# EasyEDA Pro project ProPrj_TK021F2699-RGB_转接板_24位_并联_2024-11-26.epro

# Schematic TK021F2699-RGB_转接板_24位_并联
Board Name: TK021F2699-RGB_转接板_24位_并联; Create Date: 2024-10-23; Page Name: Sheet_1; Project Name: TK021F2699-RGB_转接板_椭圆-24位; Schematic Name: TK021F2699-RGB_转接板_24位_并联; Update Date: 2024-10-23; Add into BOM: yes; Company: NULL Studio; Convert to PCB: yes; Date: 2022-07-25; Draw By: zhouao; REV: 1.0; Sheet: 1/1
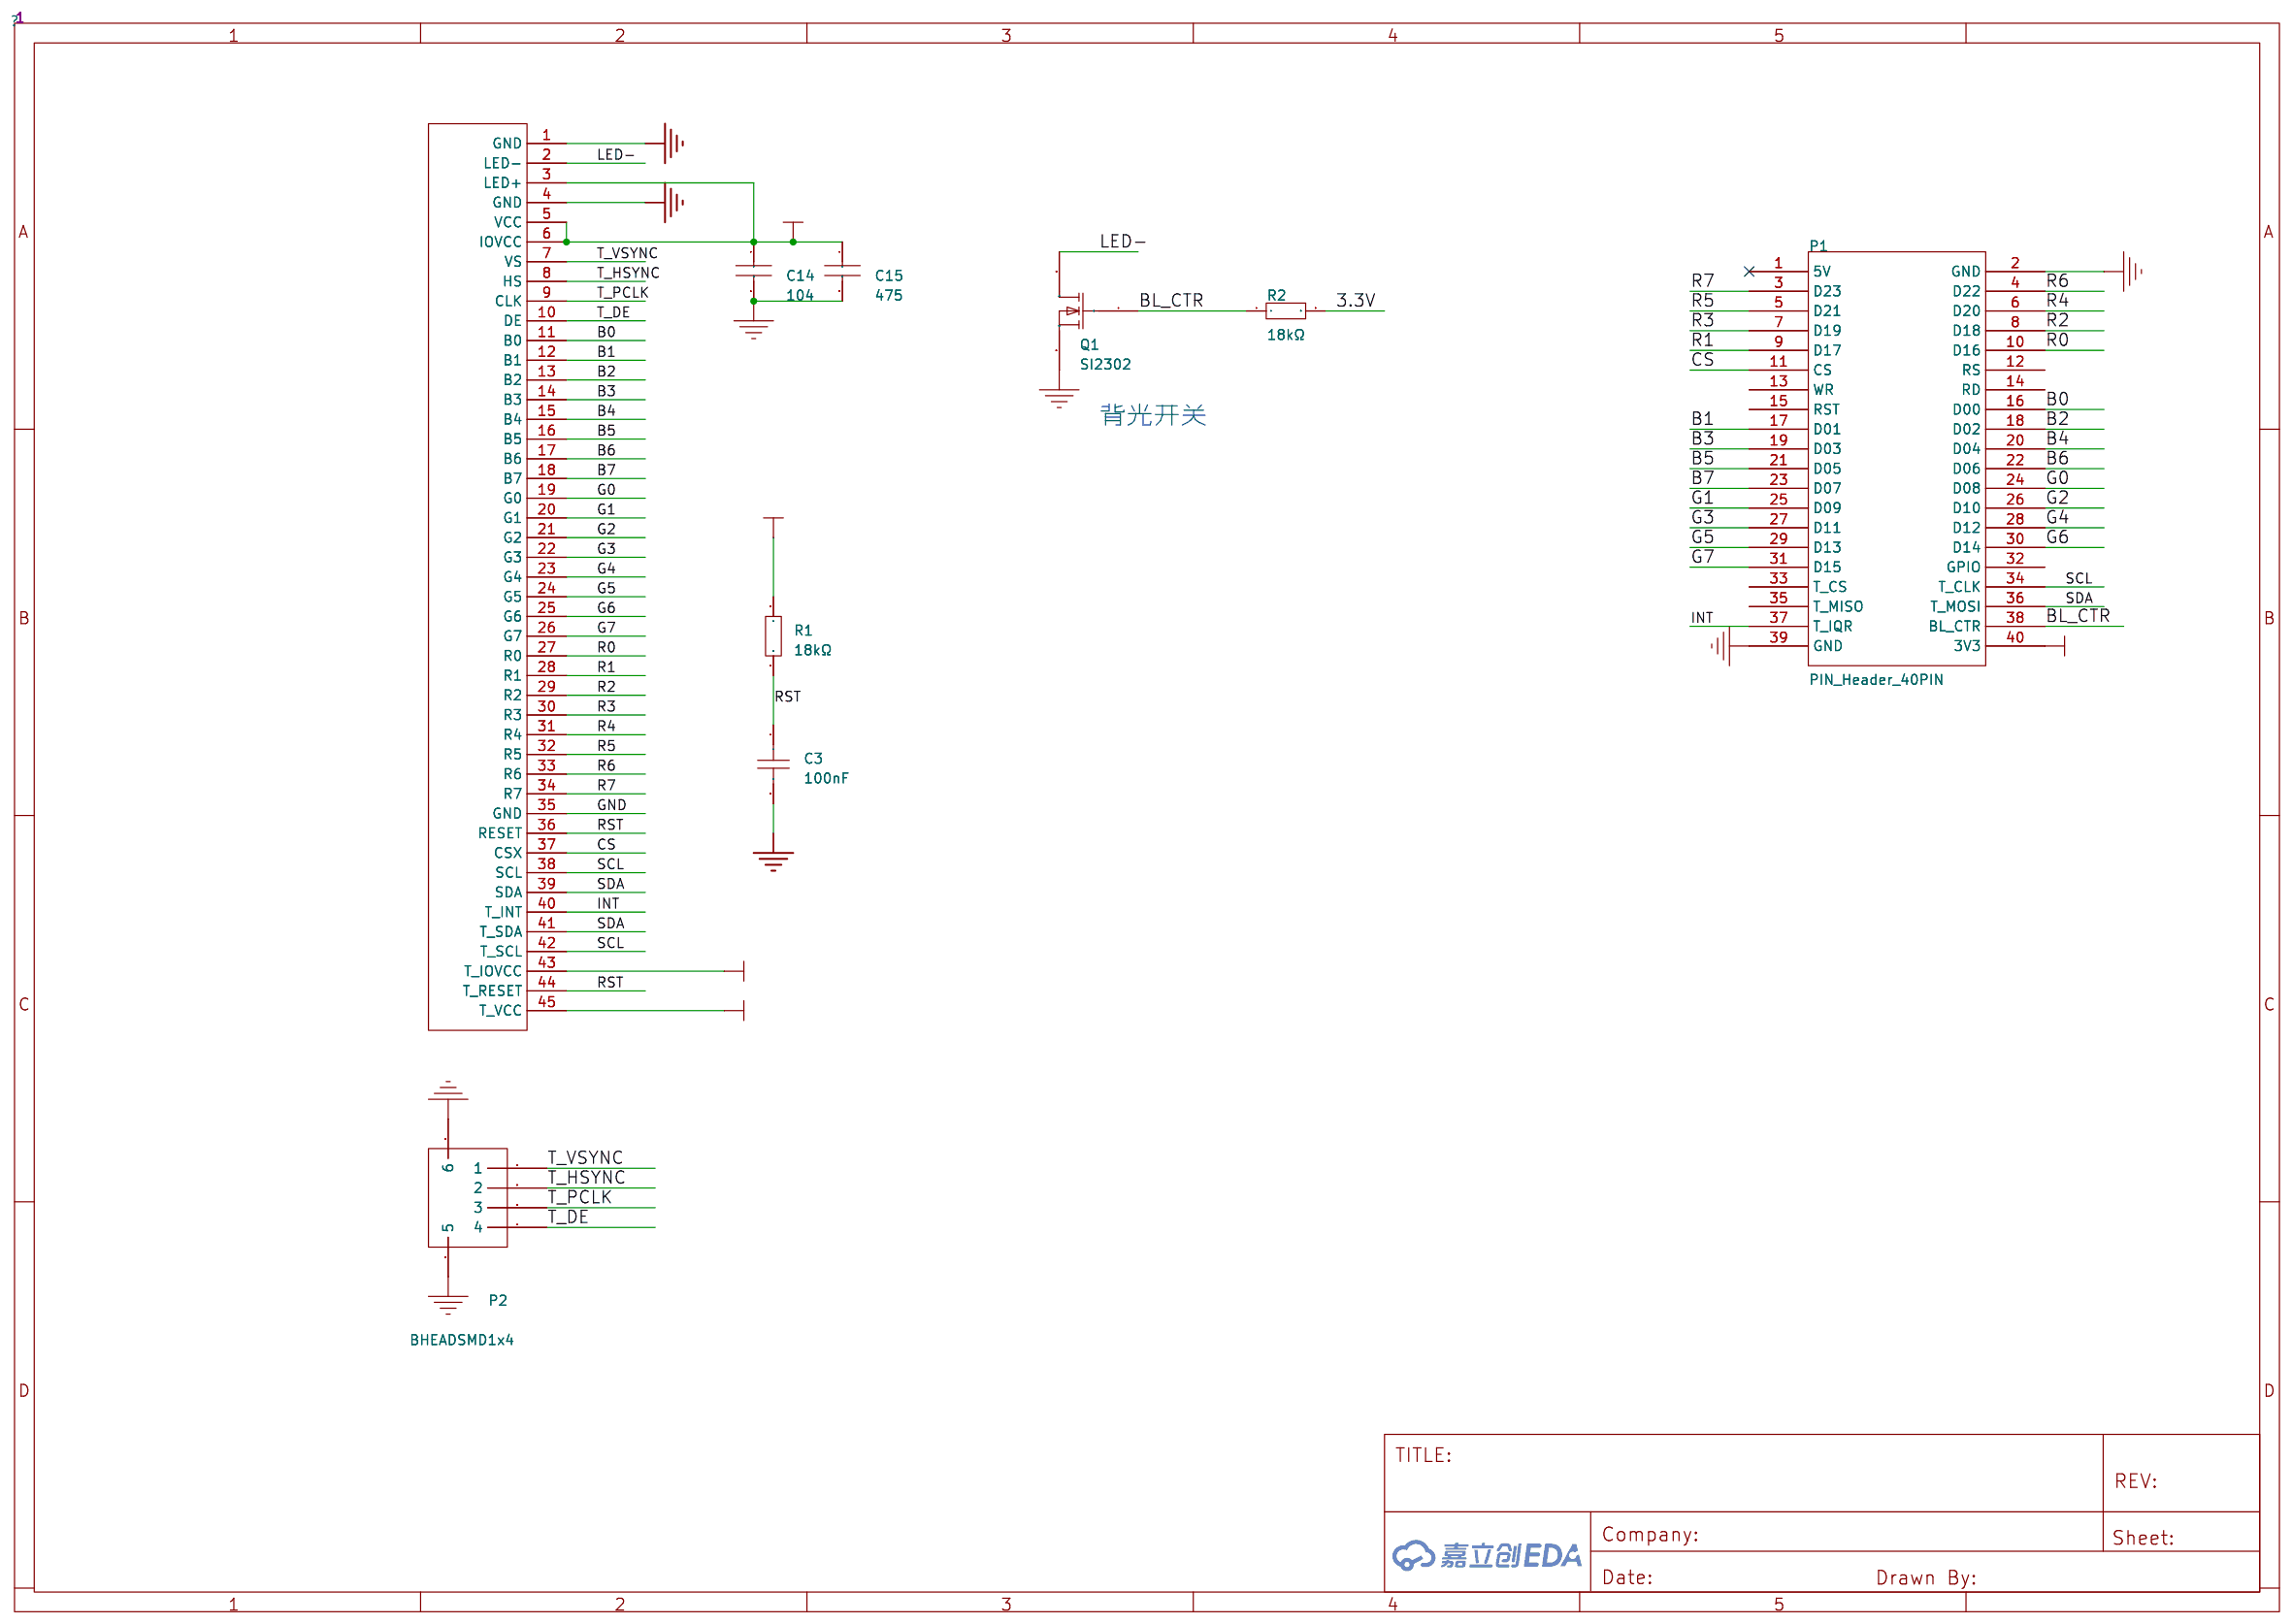
[diagram p0: schematic sheet]

## Parts
C3  100nF  [C0603]
C14  104  [C0603-1]
C15  475  [C0603-2]
P1  PIN_Header_40PIN  [P_Head_2x20]
P2  BHEADSMD1x4  [BHEADSMD1x4]
Q1  SI2302  [SOT23A]
R1  18kΩ  [R0603]
R2  18kΩ  [R0603]
U1  -  [TK043F-45P]

## Library data of the parts
C3 = CC0603KRX7R9BB104: 容值:100nF;精度:±10%;额定电压:50V;材质(温度系数):X7R;; LCSC Part Name: 100nF ±10% 50V; Supplier Part: C14663; Manufacturer: YAGEO(国巨); Supplier Footprint: 0603; Datasheet: https://atta.szlcsc.com/upload/public/pdf/source/20180910/C282072_33301C7F631E79921B82A8DAC6BCC5B3.pdf; Supplier: LCSC; Tolerance: ±10%; Voltage Rated: 50V; Temperature Coefficient: X7R
C14 = 104: Origin Footprint 2: C0402-2; Origin Footprint 3: C0402-3; Origin Footprint 5: C0603-2; Origin Footprint 6: C0603-3; Origin Footprint 7: C0805-1; Origin Footprint 8: C0805-2; Origin Footprint 9: C0805-3; Origin Footprint 10: Case B 3528; Design Item ID: cap; Library Name: Tiky
C15 = 475: Origin Footprint 2: C0402-1; Origin Footprint 3: C0402-2; Origin Footprint 4: C0402-3; Origin Footprint 5: C0603-1; Origin Footprint 6: C0603-3; Origin Footprint 7: C0805-1; Origin Footprint 8: C0805-2; Origin Footprint 9: C0805-3; Origin Footprint 10: Case B 3528; Design Item ID: cap; Library Name: Tiky
P1 = PIN_Header_40PIN: Library Name: Tiky
P2 = BHEADSMD1x4: Library Name: Tiky
Q1 = MOSFET-N: Library Name: Tiky
R1 R2 = 0603WAF1802T5E: 电阻类型:厚膜电阻;阻值:18kΩ;精度:±1%;功率:100mW;最大工作电压:75V;温度系数:±100ppm/℃;; LCSC Part Name: 18kΩ ±1% 100mW 厚膜电阻; Supplier Part: C25810; Manufacturer: UNI-ROYAL(厚声); Supplier Footprint: 0603; JLCPCB Part Class: 基础库; Datasheet: https://atta.szlcsc.com/upload/public/pdf/source/20200306/C422600_1E6D84923E4A46A82E41ADD87F860B5C.pdf; Supplier: LCSC; Type: 厚膜电阻; Tolerance: ±1%; Power(Watts): 100mW; Overload Voltage (Max): 75V; Temperature Coefficient: ±100ppm/℃; Operating Temperature Range: -55℃~+155℃
U1 = TK-RGB-45P

## Nets
3.3V: C14.1 C15.1 P1.40(3V3) R1.2 R2.2 U1.3(LED+) U1.5(VCC) U1.6(IOVCC) U1.43(T_IOVCC) U1.45(T_VCC)
GND: C3.2 C14.2 C15.2 P1.2(GND) P1.39(GND) P2.5 P2.6 Q1.2(S) U1.1(GND) U1.4(GND) U1.35(GND)
B0: P1.16(D00) U1.11(B0)
B1: P1.17(D01) U1.12(B1)
B2: P1.18(D02) U1.13(B2)
B3: P1.19(D03) U1.14(B3)
B4: P1.20(D04) U1.15(B4)
B5: P1.21(D05) U1.16(B5)
B6: P1.22(D06) U1.17(B6)
B7: P1.23(D07) U1.18(B7)
BL_CTR: P1.38(BL_CTR) Q1.1(G) R2.1
CS: P1.11(CS) U1.37(CSX)
G0: P1.24(D08) U1.19(G0)
G1: P1.25(D09) U1.20(G1)
G2: P1.26(D10) U1.21(G2)
G3: P1.27(D11) U1.22(G3)
G4: P1.28(D12) U1.23(G4)
G5: P1.29(D13) U1.24(G5)
G6: P1.30(D14) U1.25(G6)
G7: P1.31(D15) U1.26(G7)
INT: P1.37(T_IQR) U1.40(T_INT)
LED-: Q1.3(D) U1.2(LED-)
R0: P1.10(D16) U1.27(R0)
R1: P1.9(D17) U1.28(R1)
R2: P1.8(D18) U1.29(R2)
R3: P1.7(D19) U1.30(R3)
R4: P1.6(D20) U1.31(R4)
R5: P1.5(D21) U1.32(R5)
R6: P1.4(D22) U1.33(R6)
R7: P1.3(D23) U1.34(R7)
RST: C3.1 R1.1 U1.36(RESET) U1.44(T_RESET)
SCL: P1.34(T_CLK) U1.38(SCL) U1.42(T_SCL)
SDA: P1.36(T_MOSI) U1.39(SDA) U1.41(T_SDA)
T_DE: P2.4 U1.10(DE)
T_HSYNC: P2.2 U1.8(HS)
T_PCLK: P2.3 U1.9(CLK)
T_VSYNC: P2.1 U1.7(VS)

Not connected (* = marked no-connect by the designer): P1 1(5V)* 12(RS) 13(WR) 14(RD) 15(RST) 32(GPIO) 33(T_CS) 35(T_MISO)

## Notes on the sheet
- 背光开关

# Board TK021F2699-RGB_转接板_24位_并联
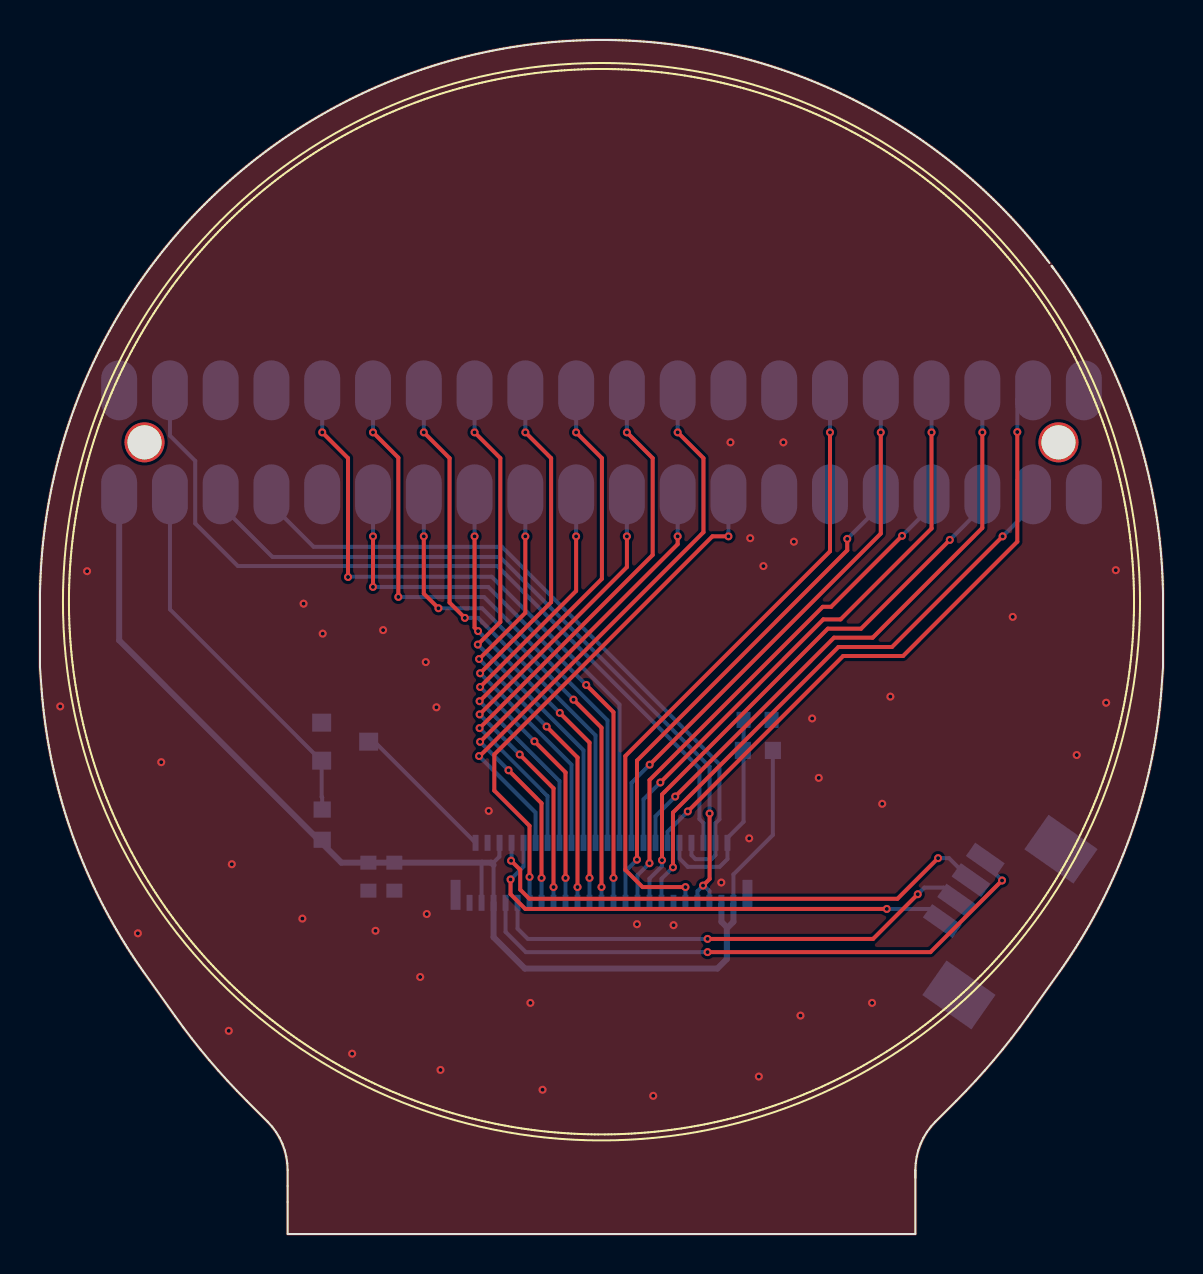
[diagram p1: board, top side]
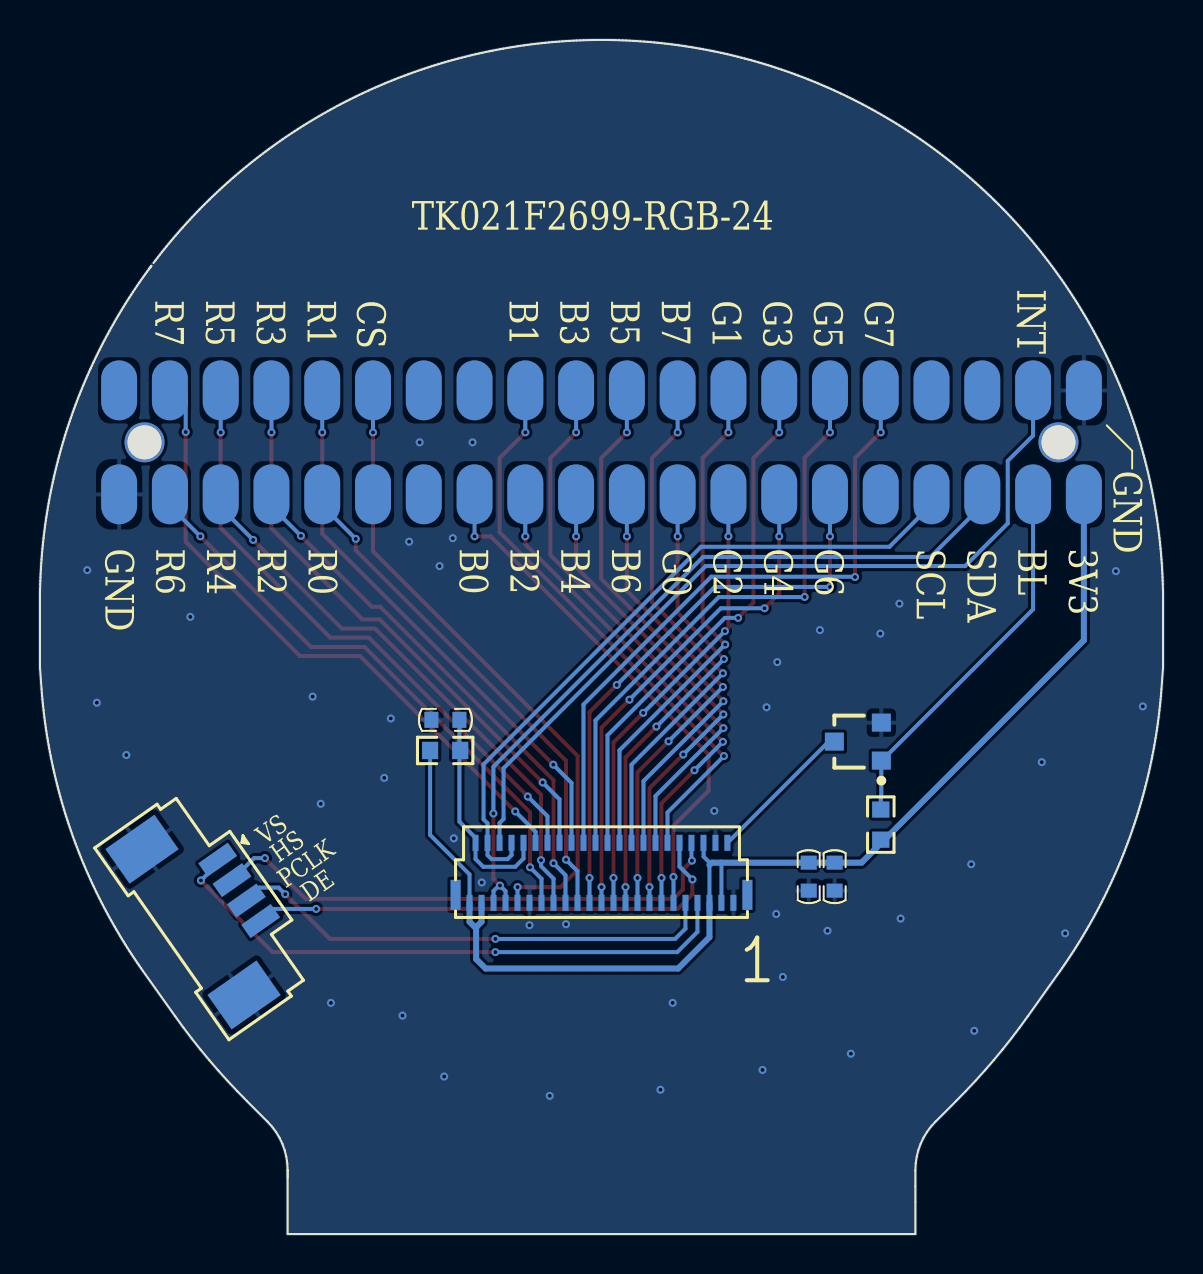
[diagram p2: board, bottom side, seen from below]

Outline 56.18 x 59.71 mm; copper layers: Top Layer, Bottom Layer. Coordinates in mm from the lower left corner of the outline.
Outline path: 43.79,3.19 43.79,0 12.39,0 12.39,3.19 12.37,3.53 12.32,3.87 12.24,4.19 12.13,4.51 11.99,4.81 11.81,5.1 11.61,5.37 11.39,5.62 10.34,6.66 9.86,7.16 9.38,7.66 8.92,8.18 8.47,8.7 8.02,9.24 7.59,9.78 7.17,10.33 6.77,10.89 5.16,13.15 5.06,13.29 4.96,13.44 4.86,13.58 4.76,13.73 4.66,13.87 4.56,14.02 4.47,14.17 4.37,14.32 4.28,14.47 4.19,14.62 4.09,14.77 4,14.92 3.91,15.07 3.82,15.22 3.73,15.38 3.65,15.53 3.56,15.68 3.47,15.84 3.39,15.99 3.31,16.15 3.22,16.3 3.14,16.46 3.06,16.62 2.98,16.78 2.9,16.93 2.83,17.09 2.75,17.25 2.67,17.41 2.6,17.57 2.52,17.73 2.45,17.89 2.38,18.05 2.31,18.21 2.24,18.38 2.17,18.54 2.1,18.7 2.04,18.87 1.97,19.03 1.91,19.19 1.84,19.36 1.78,19.52 1.72,19.69 1.66,19.86 1.6,20.02 1.54,20.19 1.49,20.36 1.43,20.52 1.37,20.69 1.32,20.86 1.27,21.03 1.22,21.19 1.16,21.36 1.11,21.53 1.07,21.7 1.02,21.87 0.97,22.04 0.93,22.21 0.88,22.38 0.84,22.56 0.8,22.73 0.76,22.9 0.72,23.07 0.68,23.24 0.64,23.42 0.6,23.59 0.57,23.76 0.53,23.93 0.5,24.11 0.47,24.28 0.43,24.45 0.4,24.63 0.37,24.8 0.35,24.98 0.32,25.15 0.29,25.33 0.27,25.5 0.24,25.67 0.22,25.85 0.2,26.02 0.18,26.2 0.16,26.38 0.14,26.55 0.12,26.73 0.11,26.9 0.09,27.08 0.08,27.25 0,28.36 0,32.01 0.01,32.5 0.02,32.68 0.03,32.86 0.04,33.03 0.04,33.21 0.06,33.38 0.07,33.56 0.08,33.74 0.09,33.91 0.11,34.09 0.12,34.26 0.14,34.44 0.16,34.61 0.18,34.79 0.2,34.97 0.22,35.14 0.24,35.32 0.27,35.49 0.29,35.67 0.32,35.84 0.35,36.01 0.37,36.19 0.4,36.36 0.43,36.54 0.47,36.71 0.5,36.88 0.53,37.06 0.57,37.23 0.6,37.4 0.64,37.58 0.68,37.75 0.72,37.92 0.76,38.09 0.8,38.26 0.84,38.43 0.88,38.61 0.93,38.78 0.97,38.95 1.02,39.12 1.07,39.29 1.11,39.46 1.16,39.63 1.22,39.8 1.27,39.96 1.32,40.13 1.37,40.3 1.43,40.47 1.49,40.64 1.54,40.8 1.6,40.97 1.66,41.14 1.72,41.3 1.78,41.47 1.84,41.63 1.91,41.8 1.97,41.96 2.04,42.12 2.1,42.29 2.17,42.45 2.24,42.61 2.31,42.78 2.38,42.94 2.45,43.1 2.52,43.26 2.6,43.42 2.67,43.58 2.75,43.74 2.83,43.9 2.9,44.06 2.98,44.22 3.06,44.37 3.14,44.53 3.22,44.69 3.31,44.84 3.39,45 3.47,45.15 3.56,45.31 3.65,45.46 3.73,45.61 3.82,45.77 3.91,45.92 4,46.07 4.09,46.22 4.19,46.37 4.28,46.52 4.37,46.67 4.47,46.82 4.56,46.97 4.66,47.12 4.76,47.26 4.86,47.41 4.96,47.55 5.06,47.7 5.16,47.84 5.26,47.99 5.36,48.13 5.47,48.27 5.57,48.42 5.68,48.56 5.79,48.7 5.89,48.84 6,48.98 6.11,49.11 6.22,49.25 6.33,49.39 6.45,49.53 6.56,49.66 6.67,49.8 6.79,49.93 6.9,50.06 7.02,50.2 7.14,50.33 7.25,50.46 7.37,50.59 7.49,50.72 7.61,50.85 7.73,50.98 7.86,51.1 7.98,51.23 8.1,51.36 8.23,51.48 8.35,51.61 8.48,51.73 8.61,51.85 8.73,51.98 8.86,52.1 8.99,52.22 9.12,52.34 9.25,52.46 9.38,52.57 9.51,52.69 9.65,52.81 9.78,52.92 9.91,53.04 10.05,53.15 10.18,53.26 10.32,53.38 10.46,53.49 10.6,53.6 10.73,53.71 10.87,53.82 11.01,53.92 11.15,54.03 11.29,54.14 11.44,54.24 11.58,54.35 11.72,54.45 11.87,54.55 12.01,54.65 12.15,54.75 12.3,54.85 12.45,54.95 12.59,55.05 12.74,55.15 12.89,55.24 13.04,55.34 13.19,55.43 13.34,55.52 13.49,55.62 13.64,55.71 13.79,55.8 13.94,55.89 14.1,55.98 14.25,56.06 14.4,56.15 14.56,56.24 14.71,56.32 14.87,56.4 15.02,56.49 15.18,56.57 15.34,56.65 15.49,56.73 15.65,56.81 15.81,56.88 15.97,56.96 16.13,57.04 16.29,57.11 16.45,57.19 16.61,57.26 16.77,57.33 16.93,57.4 17.1,57.47 17.26,57.54 17.42,57.61 17.59,57.67 17.75,57.74 17.91,57.8 18.08,57.87 18.24,57.93 18.41,57.99 18.57,58.05 18.74,58.11 18.91,58.17 19.07,58.22 19.24,58.28 19.41,58.33 19.58,58.39 19.75,58.44 19.91,58.49 20.08,58.55 20.25,58.59 20.42,58.64 20.59,58.69 20.76,58.74 20.93,58.78 21.1,58.83 21.27,58.87 21.45,58.91 21.62,58.95 21.79,58.99 21.96,59.03 22.13,59.07 22.31,59.11 22.48,59.14 22.65,59.18 22.83,59.21 23,59.25 23.17,59.28 23.35,59.31 23.52,59.34 23.7,59.36 23.87,59.39 24.04,59.42 24.22,59.44 24.39,59.47 24.57,59.49 24.74,59.51 24.92,59.53 25.09,59.55 25.27,59.57 25.45,59.59 25.62,59.6 25.8,59.62 25.97,59.63 26.15,59.64 26.33,59.65 26.5,59.67 26.68,59.67 26.85,59.68 27.03,59.69 27.21,59.7 27.38,59.7 27.56,59.7 27.74,59.71 27.91,59.71 28.09,59.71 28.27,59.71 28.44,59.71 28.62,59.7 28.8,59.7 28.97,59.7 29.15,59.69 29.33,59.68 29.5,59.67 29.68,59.67 29.85,59.65 30.03,59.64 30.21,59.63 30.38,59.62 30.56,59.6 30.73,59.59 30.91,59.57 31.08,59.55 31.26,59.53 31.43,59.51 31.61,59.49 31.79,59.47 31.96,59.44 32.14,59.42 32.31,59.39 32.48,59.36 32.66,59.34 32.83,59.31 33.01,59.28 33.18,59.25 33.35,59.21 33.53,59.18 33.7,59.14 33.87,59.11 34.05,59.07 34.22,59.03 34.39,58.99 34.56,58.95 34.73,58.91 34.9,58.87 35.08,58.83 35.25,58.78 35.42,58.74 35.59,58.69 35.76,58.64 35.93,58.59 36.1,58.55 36.27,58.49 36.43,58.44 36.6,58.39 36.77,58.33 36.94,58.28 37.11,58.22 37.27,58.17 37.44,58.11 37.61,58.05 37.77,57.99 37.94,57.93 38.1,57.87 38.27,57.8 38.43,57.74 38.59,57.67 38.76,57.61 38.92,57.54 39.08,57.47 39.25,57.4 39.41,57.33 39.57,57.26 39.73,57.19 39.89,57.11 40.05,57.04 40.21,56.96 40.37,56.88 40.53,56.81 40.68,56.73 40.84,56.65 41,56.57 41.16,56.49 41.31,56.4 41.47,56.32 41.62,56.24 41.78,56.15 41.93,56.06 42.08,55.98 42.24,55.89 42.39,55.8 42.54,55.71 42.69,55.62 42.84,55.52 42.99,55.43 43.14,55.34 43.29,55.24 43.44,55.15 43.59,55.05 43.73,54.95 43.88,54.85 44.02,54.75 44.17,54.65 44.31,54.55 44.46,54.45 44.6,54.35 44.74,54.24 44.89,54.14 45.03,54.03 45.17,53.92 45.31,53.82 45.45,53.71 45.58,53.6 45.72,53.49 45.86,53.38 45.99,53.26 46.13,53.15 46.27,53.04 46.4,52.92 46.53,52.81 46.67,52.69 46.8,52.57 46.93,52.46 47.06,52.34 47.19,52.22 47.32,52.1 47.45,51.98 47.57,51.85 47.7,51.73 47.83,51.61 47.95,51.48 48.08,51.36 48.2,51.23 48.32,51.1 48.45,50.98 48.57,50.85 48.69,50.72 48.81,50.59 48.93,50.46 49.04,50.33 49.16,50.2 49.28,50.06 49.39,49.93 49.51,49.8 49.62,49.66 49.73,49.53 49.85,49.39 49.96,49.25 50.07,49.11 50.18,48.98 50.29,48.84 50.39,48.7 50.5,48.56 ; 43.79,3.19 43.81,3.53 43.86,3.87 43.94,4.19 44.05,4.51 44.19,4.81 44.37,5.1 44.57,5.37 44.79,5.62 45.84,6.66 46.32,7.16 46.8,7.66 47.26,8.18 47.71,8.7 48.16,9.24 48.59,9.78 49.01,10.33 49.41,10.89 51.02,13.15 51.12,13.29 51.22,13.44 51.32,13.58 51.42,13.73 51.52,13.87 51.62,14.02 51.71,14.17 51.81,14.32 51.9,14.47 51.99,14.62 52.09,14.77 52.18,14.92 52.27,15.07 52.36,15.22 52.45,15.38 52.53,15.53 52.62,15.68 52.7,15.84 52.79,15.99 52.87,16.15 52.96,16.3 53.04,16.46 53.12,16.62 53.2,16.78 53.28,16.93 53.35,17.09 53.43,17.25 53.51,17.41 53.58,17.57 53.65,17.73 53.73,17.89 53.8,18.05 53.87,18.21 53.94,18.38 54.01,18.54 54.08,18.7 54.14,18.87 54.21,19.03 54.27,19.19 54.33,19.36 54.4,19.52 54.46,19.69 54.52,19.86 54.58,20.02 54.64,20.19 54.69,20.36 54.75,20.52 54.8,20.69 54.86,20.86 54.91,21.03 54.96,21.19 55.01,21.36 55.06,21.53 55.11,21.7 55.16,21.87 55.21,22.04 55.25,22.21 55.3,22.38 55.34,22.56 55.38,22.73 55.42,22.9 55.46,23.07 55.5,23.24 55.54,23.42 55.58,23.59 55.61,23.76 55.65,23.93 55.68,24.11 55.71,24.28 55.75,24.45 55.78,24.63 55.81,24.8 55.83,24.98 55.86,25.15 55.89,25.33 55.91,25.5 55.94,25.67 55.96,25.85 55.98,26.02 56,26.2 56.02,26.38 56.04,26.55 56.05,26.73 56.07,26.9 56.09,27.08 56.1,27.25 56.18,28.36 56.18,32.01 56.17,32.5 56.16,32.68 56.15,32.86 56.14,33.03 56.14,33.21 56.12,33.38 56.11,33.56 56.1,33.74 56.09,33.91 56.07,34.09 56.05,34.26 56.04,34.44 56.02,34.61 56,34.79 55.98,34.97 55.96,35.14 55.94,35.32 55.91,35.49 55.89,35.67 55.86,35.84 55.83,36.01 55.81,36.19 55.78,36.36 55.75,36.54 55.71,36.71 55.68,36.88 55.65,37.06 55.61,37.23 55.58,37.4 55.54,37.58 55.5,37.75 55.46,37.92 55.42,38.09 55.38,38.26 55.34,38.43 55.3,38.61 55.25,38.78 55.21,38.95 55.16,39.12 55.11,39.29 55.06,39.46 55.01,39.63 54.96,39.8 54.91,39.96 54.86,40.13 54.8,40.3 54.75,40.47 54.69,40.64 54.64,40.8 54.58,40.97 54.52,41.14 54.46,41.3 54.4,41.47 54.33,41.63 54.27,41.8 54.21,41.96 54.14,42.12 54.08,42.29 54.01,42.45 53.94,42.61 53.87,42.78 53.8,42.94 53.73,43.1 53.65,43.26 53.58,43.42 53.51,43.58 53.43,43.74 53.35,43.9 53.28,44.06 53.2,44.22 53.12,44.37 53.04,44.53 52.96,44.69 52.87,44.84 52.79,45 52.7,45.15 52.62,45.31 52.53,45.46 52.45,45.61 52.36,45.77 52.27,45.92 52.18,46.07 52.09,46.22 51.99,46.37 51.9,46.52 51.81,46.67 51.71,46.82 51.62,46.97 51.52,47.12 51.42,47.26 51.32,47.41 51.22,47.55 51.12,47.7 51.02,47.84 50.92,47.99 50.81,48.13 50.71,48.27 ; 43.79,3.19 43.79,2.8 ; 50.71,48.27 50.61,48.42 50.71,48.27
Stack: Top Layer 0.035mm / Dielectric1 1.51mm FR4 er 4.5 / Bottom Layer 0.035mm

## Design rules (mm)
template: 0.2MM双面板
spacing Clearance (default): track to track 0.15, other pairs 0 to 0.15
spacing Clearance_Polygon: track to track 0.15, other pairs 0 to 0.18
track width Width (default): min 0.2, default 0.2, max 0.4
differential pair DiffPairsRouting (default): width min 0.2, default 0.2, max 0.2; gap min 0.15, default 0.2
via RoutingVias (default): diameter min 0.4, default 0.4, max 1.27; hole min 0.2, default 0.2, max 0.711

## Placement (name value [footprint] x y rotation side)
C3  100nF  [C0603]  35.91 25.7 0 bottom
C14  104  [C0603-1]  17.72 18.57 270 bottom
C15  475  [C0603-2]  16.43 18.57 270 bottom
P1  PIN_Header_40PIN  [P_Head_2x20]  52.22 42.19 180 bottom
P2  -  [BHEADSMD1x4]  47.29 18.72 55 bottom
Q1  SI2302  [SOT23A]  14.09 23.67 90 bottom
R1  18kΩ  [R0603]  35.91 24.18 0 bottom
R2  18kΩ  [R0603]  14.12 20.47 270 bottom
U1  -  [tk043f-45p]  21.49 16.56 0 bottom

## Footprints (pads in the part's own frame, mm; a bottom-side part is the same pattern mirrored in y, then rotated)
BHEADSMD1x4
  rect 0.813x1.804 smd: 1(0,0) 2(-1.25,0) 3(-2.5,0) 4(-3.75,0)
  rect 2.108x2.997 smd: 5(2.6,2.8) 6(-6.3,2.8)
C0603
  rect 0.7x0.8 smd: 1(-0.712,-0.007) 2(0.688,-0.007)
C0603-1
  rect 0.7x0.8 smd: 1(0,0) 2(1.4,0)
C0603-2
  rect 0.7x0.8 smd: 1(0,0) 2(1.4,0)
P_Head_2x20
  round 2 hole 1.7: 0(1.27,-2.6) 0(46.99,-2.6)
  rrect 1.8x3 smd: 1(0,0) 2(0,-5.2) 3(2.54,0) 4(2.54,-5.2) 5(5.08,0) 6(5.08,-5.2) 7(7.62,0) 8(7.62,-5.2) 9(10.16,0) 10(10.16,-5.2) 11(12.7,0) 12(12.7,-5.2) 13(15.24,0) 14(15.24,-5.2) 15(17.78,0) 16(17.78,-5.2) 17(20.32,0) 18(20.32,-5.2) 19(22.86,0) 20(22.86,-5.2) 21(25.4,0) 22(25.4,-5.2) 23(27.94,0) 24(27.94,-5.2) 25(30.48,0) 26(30.48,-5.2) 27(33.02,0) 28(33.02,-5.2) 29(35.56,0) 30(35.56,-5.2) 31(38.1,0) 32(38.1,-5.2) 33(40.64,0) 34(40.64,-5.2) 35(43.18,0) 36(43.18,-5.2) 37(45.72,0) 38(45.72,-5.2) 39(48.26,0) 40(48.26,-5.2)
R0603
  rect 0.806x0.864 smd: 1(-0.753,0) 2(0.753,0)
SOT23A
  rect 0.9x0.95 smd: 1(0,0) 2(1.9,0) 3(0.95,2.35)
tk043f-45p
  rect 0.5x1.5 smd: 0(-0.7,-0.4) 0(13.9,-0.4)
  rect 0.3x0.8 smd: 1(0,0) 2(0.3,-3) 3(0.6,0) 4(0.9,-3) 5(1.2,0) 6(1.5,-3) 7(1.8,0) 8(2.1,-3) 9(2.4,0) 10(2.7,-3) 11(3,0) 12(3.3,-3) 13(3.6,0) 14(3.9,-3) 15(4.2,0) 16(4.5,-3) 17(4.8,0) 18(5.1,-3) 19(5.4,0) 20(5.7,-3) 21(6,0) 22(6.3,-3) 23(6.6,0) 24(6.9,-3) 25(7.2,0) 26(7.5,-3) 27(7.8,0) 28(8.1,-3) 29(8.4,0) 30(8.7,-3) 31(9,0) 32(9.3,-3) 33(9.6,0) 34(9.9,-3) 35(10.2,0) 36(10.5,-3) 37(10.8,0) 38(11.1,-3) 39(11.4,0) 40(11.7,-3) 41(12,0) 42(12.3,-3) 43(12.6,0) 44(12.9,-3) 45(13.2,0)

## Nets
As in the schematic.

Pads without a net: P1 0 1 12 13 14 15 32 33 35; U1 0

## Via types
v1: diameter 0.4, hole 0.2, Top Layer to Bottom Layer, 115 vias

## Routing (per net, layer and track width the routed paths; a pad name or vN(x,y) marks a point on that pad's centre or on a via; arc(x,y) is an arc through that point)
3.3V: length 62.9
  Bottom Layer w0.2: U1.5 22.69,18.58 22.98,18.87 22.98,19.55 U1.6 ; U1.45 34.69,17.98 36.66,19.96 R1.2 ; U1.3 22.09,18.56 22.11,18.57 ; 14.12,19.53 R2.2
  Bottom Layer w0.3: U1.45 34.69,15.61 34.42,15.34 ; U1.43 34.09,15.61 34.36,15.34 34.36,13.75 33.89,13.28 24.26,13.28 22.69,14.84 U1.5 ; 3.96,36.99 3.96,29.69 14.12,19.53 15.08,18.57 C15.1 C14.1 22.57,18.57 22.69,18.45
GND:
  vias: v1(1.01,26.38) v1(2.36,33.15) v1(4.9,15.04) v1(6.06,23.6) v1(9.44,10.16) v1(9.6,18.49) v1(13.19,31.52) v1(13.13,15.77) v1(14.14,30.02) v1(15.62,9.02) v1(16.78,15.16) v1(17.17,30.2) v1(19.02,12.85) v1(19.3,28.6) v1(19.35,16) v1(19.83,26.34) v1(20.04,8.2) v1(22.45,21.16) v1(24.53,11.56) v1(25.14,7.21) v1(29.86,15.49) v1(30.68,6.91) v1(31.69,15.44) v1(34.08,17.58) v1(34.54,39.59) v1(35.48,19.79) v1(35.53,34.8) v1(35.96,7.87) v1(36.19,33.4) v1(37.19,39.59) v1(37.71,34.62) v1(38.04,10.92) v1(38.63,25.78) v1(38.96,22.81) v1(41.62,11.56) v1(42.13,21.51) v1(42.54,26.87) v1(48.66,30.86) v1(51.86,23.95) v1(53.33,26.57) v1(53.82,33.2)
B0: length 26.5
  Top Layer w0.2: v1(24.49,17.86) 24.49,20.41 22.73,22.17 22.73,23.98 33.64,34.89 v1(34.44,34.89)
  Bottom Layer w0.2: 34.44,36.99 v1(34.44,34.89) ; v1(24.49,17.86) U1.11
B1: length 29
  Top Layer w0.2: v1(21.97,23.9) 22,23.9 33.19,35.09 33.19,38.8 v1(31.9,40.09)
  Bottom Layer w0.2: v1(21.97,23.9) 24.79,21.08 U1.12 ; P1.17 v1(31.9,40.09)
B2: length 25.8
  Top Layer w0.2: v1(31.9,34.89) 31.9,34.5 v1(22.02,24.61) ; v1(25.09,17.81) 25.09,21.54 v1(23.44,23.19)
  Bottom Layer w0.2: v1(25.09,17.81) U1.13 ; 31.9,36.99 v1(31.9,34.89) ; v1(23.44,23.19) v1(22.02,24.61)
B3: length 28.2
  Top Layer w0.2: v1(29.36,40.09) 30.65,38.8 30.65,33.96 v1(21.99,25.3)
  Bottom Layer w0.2: U1.14 25.39,21.9 v1(21.99,25.3) ; P1.19 v1(29.36,40.09)
B4: length 25
  Top Layer w0.2: v1(21.99,25.98) 29.36,33.35 v1(29.36,34.89) ; v1(25.69,17.35) 25.69,22.29 v1(24,23.98)
  Bottom Layer w0.2: v1(25.69,17.35) U1.15 ; 29.36,36.99 v1(29.36,34.89) ; v1(24,23.98) v1(21.99,25.98)
B5: length 27.4
  Top Layer w0.2: v1(21.99,26.64) 28.11,32.76 28.11,38.8 v1(26.82,40.09)
  Bottom Layer w0.2: P1.21 v1(26.82,40.09) ; v1(21.99,26.64) 25.99,22.65 U1.16
B6: length 24.2
  Top Layer w0.2: v1(26.29,17.81) 26.29,23.08 v1(24.73,24.64) ; v1(26.82,34.89) 26.82,32.16 v1(22.02,27.36)
  Bottom Layer w0.2: v1(24.73,24.64) v1(22.02,27.36) ; 26.82,36.99 v1(26.82,34.89) ; v1(26.29,17.81) U1.17
B7: length 26.5
  Top Layer w0.2: v1(24.28,40.09) 25.57,38.8 25.57,31.59 v1(22.02,28.04)
  Bottom Layer w0.2: P1.23 v1(24.28,40.09) ; v1(22.02,28.04) 26.59,23.47 U1.18
BL_CTR: length 18.9
  Bottom Layer w0.2: 6.5,36.99 6.5,31.24 14.07,23.67 Q1.1 14.09,21.85 14.12,21.83 R2.1
CS: length 32.4
  Top Layer w0.2: v1(39.52,40.09) 39.52,34.14 29.28,23.9 29.28,18.21 30.14,17.35 v1(32.29,17.35)
  Bottom Layer w0.2: P1.11 v1(39.52,40.09) ; U1.37 v1(32.29,17.35)
G0: length 23.4
  Top Layer w0.2: v1(21.97,28.75) 24.28,31.07 v1(24.28,34.89) ; v1(25.34,25.37) 26.89,23.83 v1(26.89,17.35)
  Bottom Layer w0.2: v1(25.34,25.37) v1(21.97,28.75) ; 24.28,36.99 v1(24.28,34.89) ; v1(26.89,17.35) U1.19
G1: length 25.8
  Top Layer w0.2: v1(21.9,29.48) 23.03,30.6 23.03,38.8 v1(21.74,40.09)
  Bottom Layer w0.2: U1.20 27.19,24.19 v1(21.9,29.48) ; P1.25 v1(21.74,40.09)
G2: length 22.8
  Top Layer w0.2: v1(21.92,30.15) 21.74,30.33 v1(21.74,34.89) ; v1(27.49,17.81) 27.49,24.58 v1(26,26.06)
  Bottom Layer w0.2: v1(27.49,17.81) U1.21 ; v1(26,26.06) v1(21.92,30.15) ; 21.74,36.99 v1(21.74,34.89)
G3: length 26.6
  Top Layer w0.2: v1(19.2,40.09) 20.49,38.8 20.49,31.58 v1(21.25,30.81)
  Bottom Layer w0.2: U1.22 27.79,24.94 21.92,30.81 v1(21.25,30.81) ; P1.27 v1(19.2,40.09)
G4: length 25.4
  Top Layer w0.2: v1(19.93,31.29) 19.2,32.03 v1(19.2,34.89) ; v1(26.69,26.72) 28.09,25.32 v1(28.09,17.35)
  Bottom Layer w0.2: v1(19.93,31.29) 22.12,31.29 v1(26.69,26.72) ; v1(28.09,17.35) U1.23 ; 19.2,36.99 v1(19.2,34.89)
G5: length 30
  Top Layer w0.2: v1(17.93,31.86) 17.93,38.82 v1(16.66,40.09)
  Bottom Layer w0.2: P1.29 v1(16.66,40.09) ; 17.93,31.85 22.22,31.85 28.39,25.68 U1.24
G6: length 28.8
  Top Layer w0.2: v1(16.66,34.89) 16.66,32.36 v1(16.66,32.36) ; v1(27.33,27.46) 28.69,26.09 v1(28.69,17.81)
  Bottom Layer w0.2: v1(28.69,17.81) U1.25 ; v1(16.66,32.36) 22.42,32.36 v1(27.33,27.46) ; 16.66,36.99 v1(16.66,34.89)
G7: length 33
  Top Layer w0.2: v1(15.41,32.85) 15.41,38.8 v1(14.12,40.09)
  Bottom Layer w0.2: P1.31 v1(14.12,40.09) ; U1.26 28.99,26.48 22.6,32.87 15.41,32.87
INT: length 41.3
  Bottom Layer w0.2: P1.37 6.5,39.93 7.77,38.66 7.77,35.53 9.9,33.4 22.88,33.4 32.99,23.29 32.99,20.75 33.19,20.55 U1.40
LED-: length 7.4
  Bottom Layer w0.2: U1.2 16.73,24.62 Q1.3
R0: length 25.7
  Top Layer w0.2: v1(29.86,18.72) 29.86,23.67 40.38,34.19 v1(40.38,34.76)
  Bottom Layer w0.2: v1(29.86,18.72) 29.29,18.14 U1.27 ; v1(40.38,34.76) 42.06,36.44 42.06,36.99
R1: length 27.8
  Top Layer w0.2: v1(30.5,23.47) 42.06,35.03 v1(42.06,40.09)
  Bottom Layer w0.2: v1(30.5,23.47) 29.59,22.56 U1.28 ; P1.9 v1(42.06,40.09)
R2: length 26.8
  Top Layer w0.2: v1(30.49,18.54) 30.49,22.7 39.16,31.36 39.58,31.36 v1(43.13,34.91)
  Bottom Layer w0.2: v1(30.49,18.54) 29.89,17.94 U1.29 ; v1(43.13,34.91) 44.6,36.39 44.6,36.99
R3: length 29.1
  Top Layer w0.2: v1(44.6,40.09) 44.6,35.28 40.05,30.74 39.19,30.74 v1(31.03,22.58)
  Bottom Layer w0.2: P1.7 v1(44.6,40.09) ; v1(31.03,22.58) 30.19,21.74 U1.30
R4: length 28.3
  Top Layer w0.2: v1(45.51,34.71) 41.08,30.27 39.41,30.27 31.12,21.98 v1(31.12,18.69)
  Bottom Layer w0.2: U1.31 30.49,17.77 31.12,18.4 v1(31.12,18.69) ; v1(45.51,34.71) 47.14,36.34 47.14,36.99
R5: length 30.5
  Top Layer w0.2: v1(31.78,21.88) 39.72,29.82 41.65,29.82 47.14,35.31 v1(47.14,40.09)
  Bottom Layer w0.2: U1.32 30.79,20.89 v1(31.78,21.88) ; P1.5 v1(47.14,40.09)
R6: length 29.7
  Top Layer w0.2: v1(48.16,34.89) 42.62,29.36 39.94,29.36 31.67,21.08 v1(31.67,18.34)
  Bottom Layer w0.2: v1(48.16,34.89) 49.68,36.41 49.68,36.99 ; U1.33 31.09,17.76 v1(31.67,18.34)
R7: length 32.2
  Top Layer w0.2: v1(48.89,40.11) 48.89,34.62 43.17,28.91 40.18,28.91 v1(32.4,21.13)
  Bottom Layer w0.2: P1.3 49.35,42.19 48.89,41.73 v1(48.89,40.11) ; U1.34 31.39,20.12 v1(32.4,21.13)
RST: length 10.8
  Bottom Layer w0.2: U1.36 31.99,18.78 32.4,18.36 34.01,18.36 34.39,18.75 U1.44 34.39,19.81 35.2,20.62 C3.1
SCL: length 34.9
  Bottom Layer w0.2: U1.38 32.59,18.95 32.79,18.75 33.59,18.75 33.79,18.95 U1.42 33.79,20.54 33.99,20.74 33.99,23.48 23.11,34.37 13.68,34.37 11.58,36.47 11.58,36.99
SDA: length 38.5
  Top Layer w0.2: v1(33.17,17.42) 33.5,17.75 v1(33.5,21.03)
  Bottom Layer w0.2: U1.41 33.49,17.15 33.22,17.42 v1(33.17,17.42) 32.89,17.14 U1.39 ; 9.04,36.99 9.04,36.45 11.63,33.86 23.01,33.86 33.5,23.37 v1(33.5,21.03)
T_DE: length 25
  Top Layer w0.2: v1(42.36,16.26) 24.28,16.26 23.54,16.99 v1(23.54,17.73)
  Bottom Layer w0.2: U1.10 24.19,18.38 v1(23.54,17.73) ; v1(42.36,16.26) 44.53,16.26 P2.4
T_HSYNC: length 26.6
  Top Layer w0.2: v1(23.57,18.67) 24.02,18.21 24.02,17.22 24.48,16.76 42.89,16.76 v1(44.93,18.8)
  Bottom Layer w0.2: v1(44.93,18.8) 45.47,18.8 P2.2 ; U1.8 23.59,18.69 v1(23.57,18.67)
T_PCLK: length 24.8
  Top Layer w0.2: v1(33.4,14.76) 41.68,14.76 v1(43.91,16.99)
  Bottom Layer w0.2: P2.3 45.2,17.32 44.24,17.32 v1(43.91,16.99) ; U1.9 23.89,15.27 24.4,14.76 v1(33.4,14.76)
T_VSYNC: length 29.6
  Top Layer w0.2: v1(48.13,17.68) 44.55,14.1 v1(33.4,14.1)
  Bottom Layer w0.2: P2.1 47.29,18.52 v1(48.13,17.68) ; U1.7 23.29,15.11 24.3,14.1 v1(33.4,14.1)

## Copper pours and planes (outline as drawn; the poured copper is in the pictures)
GND on Top Layer: -0.34,60.45 56.74,60.45 56.74,-1.57 -0.34,-1.57
GND on Bottom Layer: -5.82,60.73 60.88,60.73 60.88,-1.3 -5.82,-1.3

## Text on the board
Bottom Silkscreen Layer: 1 | DE | PCLK | HS | VS | TK021F2699-RGB-24 | GND | 3V3 | BL | INT | SDA | SCL | G7 | G6 | G5 | G4 | G3 | G2 | G1 | G0 | B7 | B6 | B5 | B4 | B3 | B2 | B1 | B0 | CS | R0 | R1 | R2 | R3 | R4 | R5 | R6 | R7
